# EAGLE design arbc (EAGLE 9.6.2)
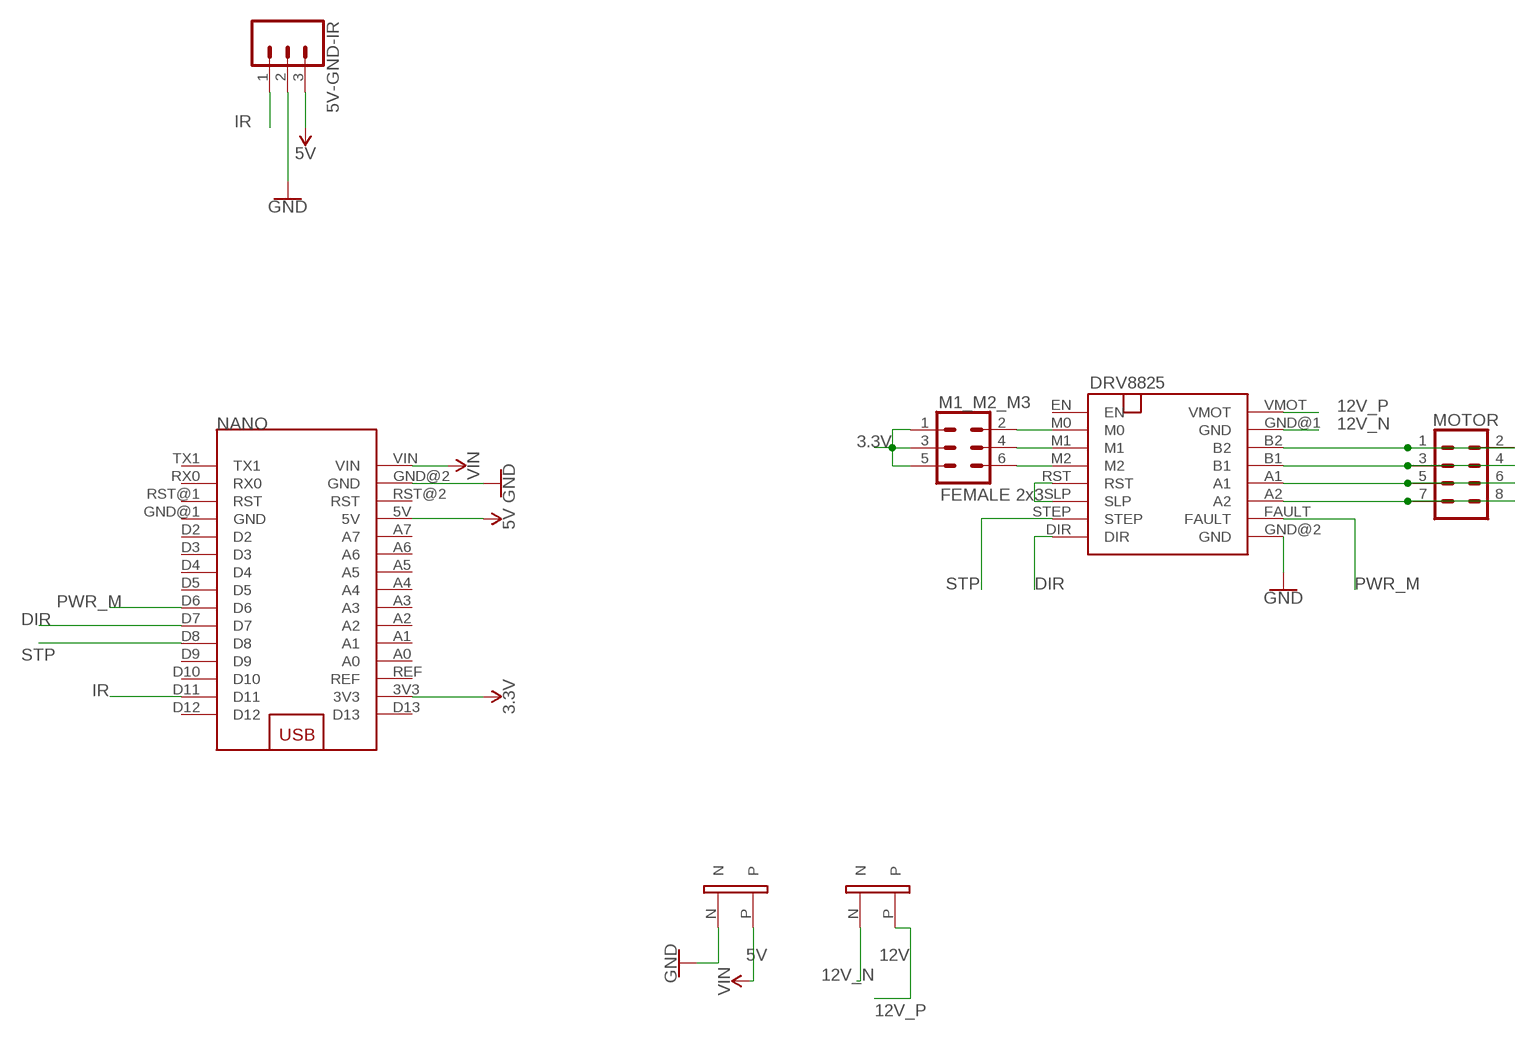
[diagram p0: schematic, sheet 1]

## Parts
5V  5MM_CONNECTOR  [5MM_CONNECTOR]
5V-GND-IR  CONN_03  [1X03]
12V  5MM_CONNECTOR  [5MM_CONNECTOR]
DRV8825  DRV8825  [DRV8825]
M1_M2_M3  FEMALE 2x3  CONN_03X2FEMALE  [2X3]
MOTOR  CONN_04X2  [2X4]
NANO  ARDUINO_NANO  [ARDUINO_NANO]

## Nets
3.3V: M1_M2_M3.1 M1_M2_M3.3 M1_M2_M3.5 NANO.3V3
5V: 5V-GND-IR.3 NANO.5V
12V_N: 12V.N DRV8825.GND@1(GND)
12V_P: 12V.P DRV8825.VMOT
DIR: DRV8825.DIR NANO.D7
GND: 5V-GND-IR.2 5V.N DRV8825.GND@2(GND) NANO.GND@2(GND)
IR: 5V-GND-IR.1 NANO.D11
N$1: DRV8825.M0 M1_M2_M3.2
N$2: DRV8825.M1 M1_M2_M3.4
N$3: DRV8825.M2 M1_M2_M3.6
N$4: DRV8825.B2 MOTOR.1 MOTOR.2
N$5: DRV8825.B1 MOTOR.3 MOTOR.4
N$6: DRV8825.A1 MOTOR.5 MOTOR.6
N$7: DRV8825.A2 MOTOR.7 MOTOR.8
N$10: DRV8825.RST DRV8825.SLP
PWR_M: DRV8825.FAULT NANO.D6
STP: DRV8825.STEP NANO.D8
VIN: 5V.P NANO.VIN
Unconnected: DRV8825.EN NANO.A0 NANO.A1 NANO.A2 NANO.A3 NANO.A4 NANO.A5 NANO.A6 NANO.A7 NANO.D2 NANO.D3 NANO.D4 NANO.D5 NANO.D9 NANO.D10 NANO.D12 NANO.D13 NANO.GND@1(GND) NANO.REF NANO.RST@1(RST) NANO.RST@2(RST) NANO.RX0 NANO.TX1

## Library data of the parts
5V 12V = ArduinoLib:5MM_CONNECTOR
5V-GND-IR = SparkFun-Connectors:CONN_03: Multi connection point. Often used as Generic Header-pin footprint for 0.1 inch spaced/style header connections On any of the 0.1 inch spaced packages, you can populate with these: Break Away Headers - Straight <https://www.sparkfun.com/products/116> (PRT-00116) Break Away Male Headers - Right Angle <https://www.sparkfun.com/products/553> (PRT-00553) Female Headers <https://www.sparkfun.com/products/115> (PRT-00115) Break Away Headers - Machine Pin <https://www.sparkfun.com/products/117> (PRT-00117) Break Away Female Headers - Swiss Machine Pin <https://www.sparkfun.com/products/743> (PRT-00743) Stackable Header - 3 Pin (Female, 0.1") <https://www.sparkfun.com/products/13875> (PRT-13875) For SCREWTERMINALS and SPRING TERMINALS visit here: Screw Terimnals on SparkFun.com <https://www.sparkfun.com/search/results?term=Screw+Terminals> (5mm/3.5mm/2.54mm spacing) This device is also useful as a general connection point to wire up your design to another part of your project. Our various solder wires solder well into these plated through hole pads. Hook-Up Wire - Assortment (Stranded, 22 AWG) <https://www.sparkfun.com/products/11375> (PRT-11375) Hook-Up Wire - Assortment (Solid Core, 22 AWG) <https://www.sparkfun.com/products/11367> (PRT-11367) View the entire wire category on our website here <https://www.sparkfun.com/categories/141> Special notes: Molex polarized connector foot print use with SKU : PRT-08232 with associated crimp pins and housings.
DRV8825 = ArduinoLib:DRV8825: DRV8825 (full ver.)
M1_M2_M3 = SparkFun-Connectors:CONN_03X2: Multi connection point. Often used as Generic Header-pin footprint for 0.1 inch spaced/style header connections You can populate with any combo of single row headers, but if you'd like an exact match, check these: Header - 2x3 (Male, 0.1") <https://www.sparkfun.com/products/12807> (PRT-12807) Header - 2x3 (Female, 0.1") <https://www.sparkfun.com/products/13010> (PRT-13010) 2x3 Pin Shrouded Header <https://www.sparkfun.com/products/10877> (PRT-10877) On any of the 0.1 inch spaced packages, you can populate with these: Break Away Headers - Straight <https://www.sparkfun.com/products/116> (PRT-00116) Break Away Male Headers - Right Angle <https://www.sparkfun.com/products/553> (PRT-00553) Female Headers <https://www.sparkfun.com/products/115> (PRT-00115) Break Away Headers - Machine Pin <https://www.sparkfun.com/products/117> (PRT-00117) Break Away Female Headers - Swiss Machine Pin <https://www.sparkfun.com/products/743> (PRT-00743) Special note: the shrouded connector mates well with our 3x2 ribbon cables: Ribbon Crimp Connector - 6-pin (2x3, Female) <https://www.sparkfun.com/products/10651> (PRT-10651) Ribbon Cable - 6 wire (15ft) <https://www.sparkfun.com/products/10646> (PRT-10646); PROD_ID: CONN-11566
MOTOR = SparkFun-Connectors:CONN_04X2: Multi connection point. Often used as Generic Header-pin footprint for 0.1 inch spaced/style header connections On any of the 0.1 inch spaced packages, you can populate with these: Break Away Headers - Straight <https://www.sparkfun.com/products/116> (PRT-00116) Break Away Male Headers - Right Angle <https://www.sparkfun.com/products/553> (PRT-00553) Female Headers <https://www.sparkfun.com/products/115> (PRT-00115) Break Away Headers - Machine Pin <https://www.sparkfun.com/products/117> (PRT-00117) Break Away Female Headers - Swiss Machine Pin <https://www.sparkfun.com/products/743> (PRT-00743)
NANO = ArduinoLib:ARDUINO_NANO: ARDUINO NANO DEVICE

## Board
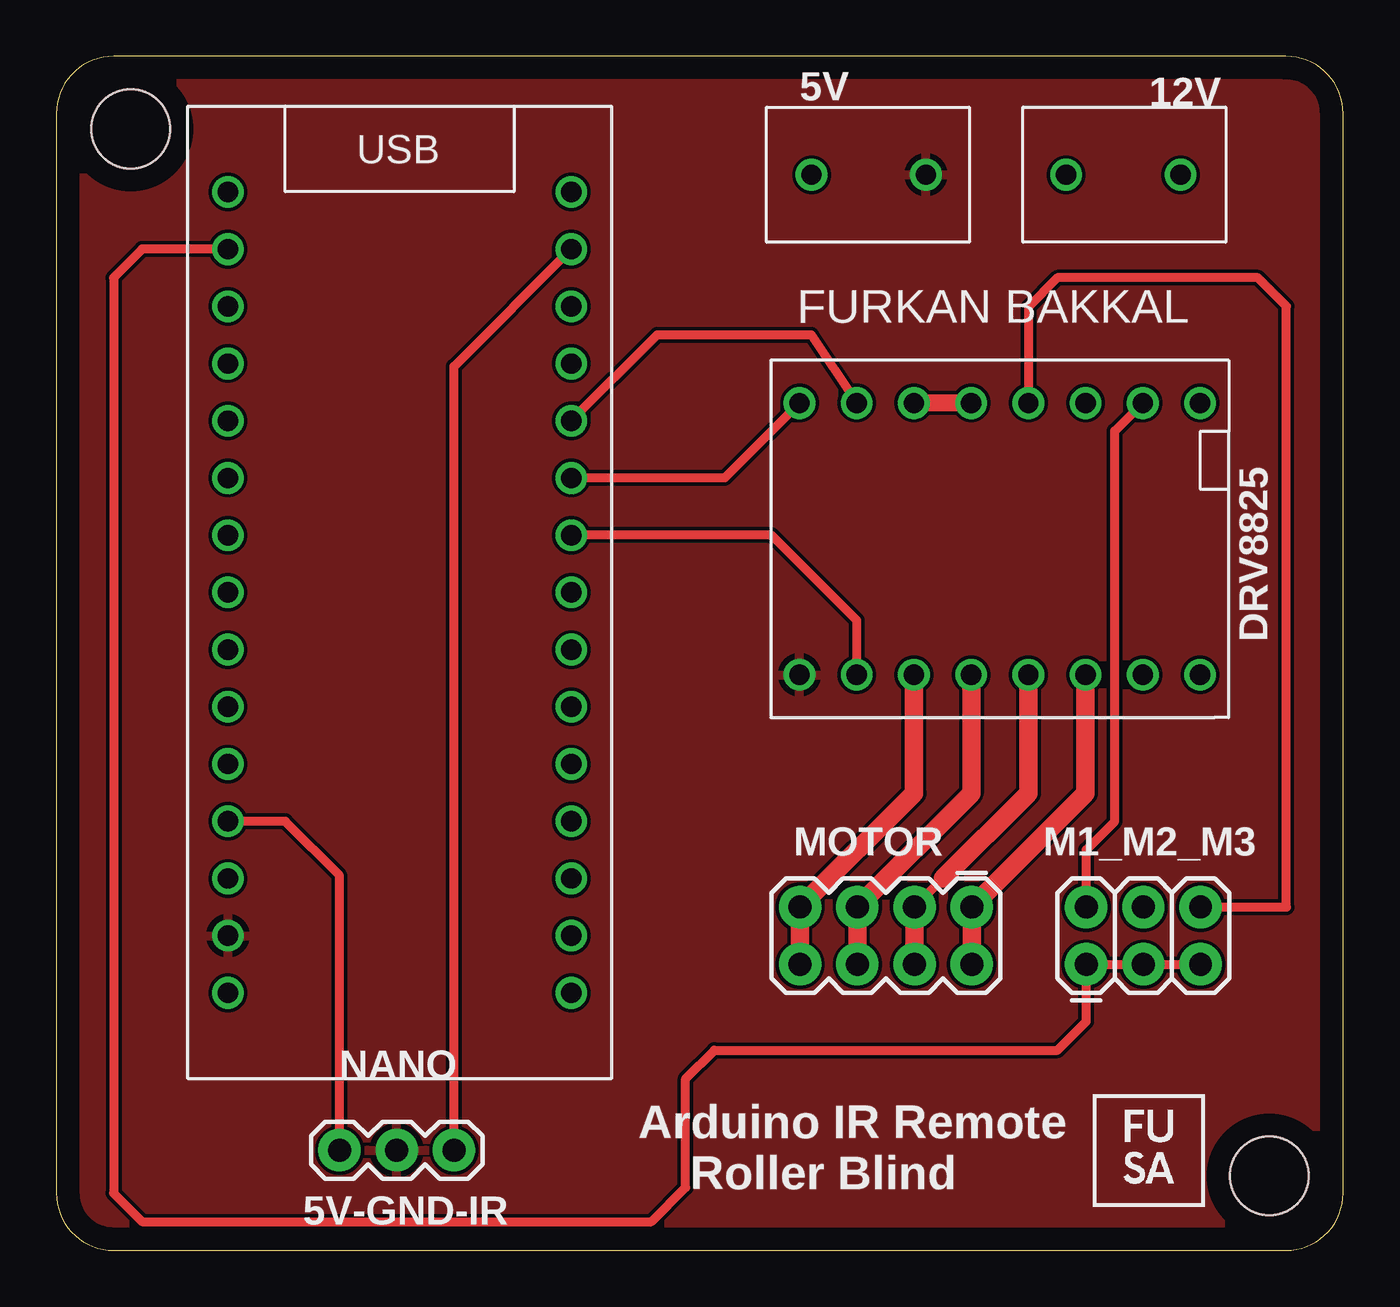
[diagram p1: board, top side]
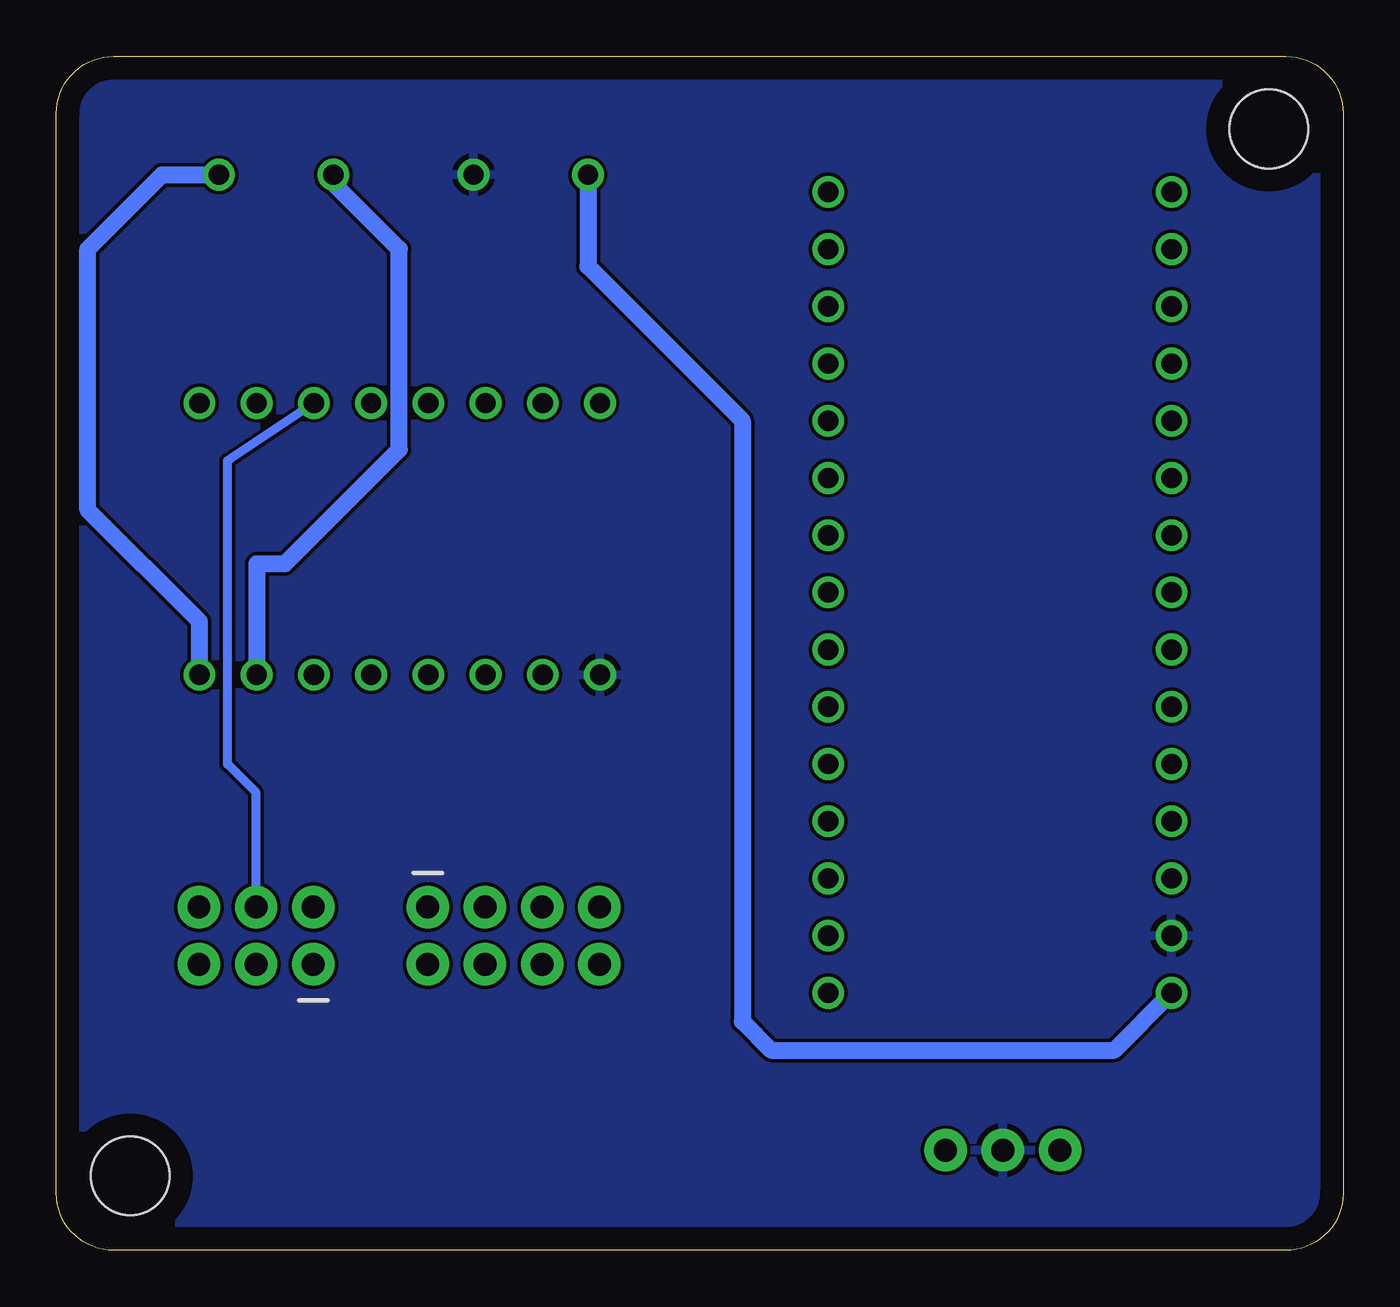
[diagram p2: board, bottom side, seen from below]

Size 57.13 x 53.01 mm. Coordinates in mm from the lower left corner, seen from the top.
Outline: 0,50.47 0,2.54 arc90 2.54,0 54.59,0 arc90 57.13,2.54 57.13,50.47 arc90 54.59,53.01 2.54,53.01 arc90 0,50.47
Copper layers (1*16): Top 0.035mm / dielectric 1.5mm / Bottom 0.035mm
Design rules "default": minimum track width 6mil, minimum drill 0.35mm, track to track 6mil, track to pad 6mil, pad to pad 6mil, via to via 6mil, smd to smd 6mil, copper to edge 40mil, drill to drill 6mil, minimum pad ring 10mil, minimum via ring 8mil, stop-mask expansion 4mil, vias tented up to drill 0mil, thermal gap 10mil
Holes 3.5 mm at 3.3,49.78 53.85,3.3

### Footprints (pad centres in the part's own frame; a part is rotated, then mirrored left to right if it is on the bottom)
5MM_CONNECTOR = drill 0.9: N 5.08,0; P 0,0
1X03 = drill 1.016 pad 1.88: 1 0,0; 2 2.54,0; 3 5.08,0
DRV8825 = drill 0.9: A1 13.335,-10.16; A2 13.335,-12.7; B1 13.335,-7.62; B2 13.335,-5.08; DIR 1.27,-17.78; EN 1.27,0; FAULT 13.335,-15.24; GND@1 13.335,-2.54; GND@2 13.335,-17.78; M0 1.27,-2.54; M1 1.27,-5.08; M2 1.27,-7.62; RST 1.27,-10.16; SLP 1.27,-12.7; STEP 1.27,-15.24; VMOT 13.335,0
2X3 = drill 1.016 pad 1.88: 1 0,0; 2 0,2.54; 3 2.54,0; 4 2.54,2.54; 5 5.08,0; 6 5.08,2.54
2X4 = drill 1.016 pad 1.88: 1 -3.81,-1.27; 2 -3.81,1.27; 3 -1.27,-1.27; 4 -1.27,1.27; 5 1.27,-1.27; 6 1.27,1.27; 7 3.81,-1.27; 8 3.81,1.27
ARDUINO_NANO = drill 0.9: 3V3 7.62,-15.24; 5V 7.62,10.16; A0 7.62,-10.16; A1 7.62,-7.62; A2 7.62,-5.08; A3 7.62,-2.54; A4 7.62,0; A5 7.62,2.54; A6 7.62,5.08; A7 7.62,7.62; D2 -7.62,7.62; D3 -7.62,5.08; D4 -7.62,2.54; D5 -7.62,0; D6 -7.62,-2.54; D7 -7.62,-5.08; D8 -7.62,-7.62; D9 -7.62,-10.16; D10 -7.62,-12.7; D11 -7.62,-15.24; D12 -7.62,-17.78; D13 7.62,-17.78; GND@1 -7.62,10.16; GND@2 7.62,15.24; REF 7.62,-12.7; RST@1 -7.62,12.7; RST@2 7.62,12.7; RX0 -7.62,15.24; TX1 -7.62,17.78; VIN 7.62,17.78

### Placement (x,y rotation side)
5V  33.53,47.75 0 top
5V-GND-IR  17.65,4.45 180 top
12V  49.91,47.75 180 top
DRV8825  50.77,38.89 270 top
M1_M2_M3  45.72,12.7 0 top
MOTOR  36.83,13.97 180 top
NANO  15.24,29.21 180 top

### Tracks (layer width: path | path; a pad name or v marks a point on that pad's centre or on a via)
3.3V
  Top 0.406: NANO.3V3 3.81,44.45 2.54,43.18 2.54,2.54 3.81,1.27 26.42,1.27 27.94,2.79 27.94,7.62 29.21,8.89 44.45,8.89 45.72,10.16 M1_M2_M3.1 M1_M2_M3.3 M1_M2_M3.5
5V
  Top 0.406: 5V-GND-IR.3 12.57,16.64 10.16,19.05 NANO.5V
12V_N
  Bottom 0.762: DRV8825.GND@1 48.23,30.48 46.99,30.48 41.91,35.56 41.91,44.45 44.83,47.37 12V.N
12V_P
  Bottom 0.762: DRV8825.VMOT 50.77,27.91 55.73,32.87 55.73,44.45 52.43,47.75 12V.P
DIR
  Top 0.406: DRV8825.DIR 29.67,34.29 NANO.D7
GND
  pour Top: 12.7,55.88 1.27,55.88 -2.54,52.07 -2.54,-3.81 arc90 -1.27,-5.08 58.42,-5.08 arc90 62.23,-1.27 62.23,50.8 arc90 57.15,55.88
  pour Bottom: 6,64.01 -8,64.01 arc90 -14,58.01 -14,7.01 arc90 6,-12.99 58,-12.99 arc90 69,-1.99 69,50.01 arc90 54,65.01 7,65.01 arc90
IR
  Top 0.406: 5V-GND-IR.1 17.65,39.24 NANO.D11
N$1
  Top 0.406: M1_M2_M3.2 45.72,17.78 46.99,19.05 46.99,36.37 DRV8825.M0
N$2
  Bottom 0.406: M1_M2_M3.4 48.26,20.32 49.53,21.59 49.53,35.06 DRV8825.M1
N$3
  Top 0.406: M1_M2_M3.6 54.61,15.24 54.61,41.91 53.34,43.18 44.45,43.18 43.16,41.88 DRV8825.M2
N$4
  Top 0.813: DRV8825.B2 45.7,20.29 MOTOR.1 MOTOR.2
N$5
  Top 0.406: 39.37,16.51 MOTOR.3
  Top 0.813: DRV8825.B1 43.16,20.29 39.37,16.51 | MOTOR.4 MOTOR.3
N$6
  Top 0.813: DRV8825.A1 40.62,20.29 MOTOR.5 MOTOR.6
N$7
  Top 0.813: DRV8825.A2 38.08,20.29 MOTOR.7 MOTOR.8
N$10
  Top 0.762: DRV8825.RST DRV8825.SLP
PWR_M
  Top 0.406: DRV8825.FAULT 35.53,27.96 31.75,31.75 NANO.D6
STP
  Top 0.406: DRV8825.STEP 33.52,40.64 26.67,40.64 NANO.D8
VIN
  Bottom 0.762: 5V.P 33.53,43.69 26.67,36.83 26.67,10.16 25.4,8.89 10.16,8.89 NANO.VIN

### Text on the board
tPlace: FURKAN BAKKAL | Arduino IR Remote / Roller Blind